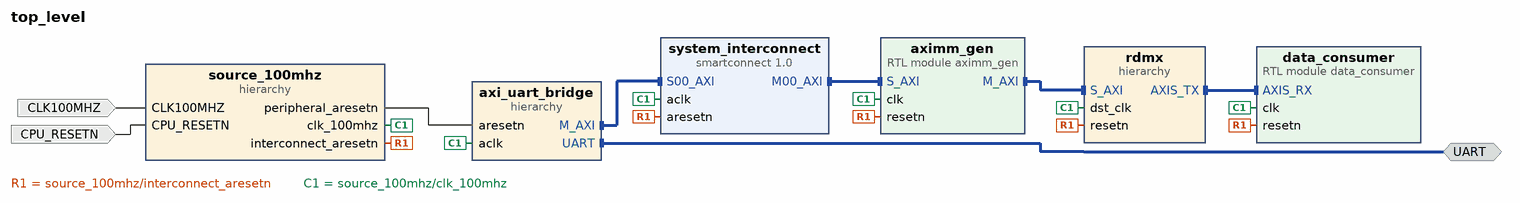
[diagram p0: block diagram of the top level]
# Vivado block design top_level, xc7a100tcsg324-1, Vivado 2021.1
create_bd_design top_level

create_bd_intf_port -mode Master -vlnv xilinx.com:interface:uart_rtl:1.0 UART
create_bd_port -dir I -type clk CLK100MHZ
set_property -dict {CONFIG.ASSOCIATED_RESET CPU_RESETN} [get_bd_ports CLK100MHZ]
create_bd_port -dir I -type rst CPU_RESETN

create_bd_cell -type ip -vlnv xilinx.com:ip:smartconnect:1.0 system_interconnect
set_property -dict {CONFIG.NUM_SI 2} [get_bd_cells system_interconnect]
create_bd_cell -type hier source_100mhz
create_bd_cell -type hier axi_uart_bridge
create_bd_cell -type module -reference data_consumer data_consumer
create_bd_cell -type hier rdmx
create_bd_cell -type module -reference aximm_gen aximm_gen

# ---- hierarchy /source_100mhz ----
current_bd_instance /source_100mhz
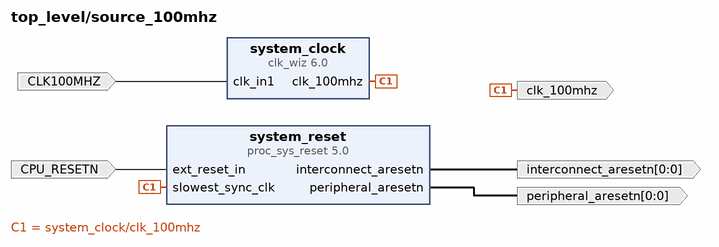
[diagram p1: block diagram inside /source_100mhz]
create_bd_pin -dir I -type clk CLK100MHZ
create_bd_pin -dir O -type clk clk_100mhz
create_bd_pin -dir I -type rst CPU_RESETN
create_bd_pin -dir O -from 0 -to 0 -type rst interconnect_aresetn
create_bd_pin -dir O -from 0 -to 0 -type rst peripheral_aresetn

create_bd_cell -type ip -vlnv xilinx.com:ip:clk_wiz:6.0 system_clock
set_property -dict [list \
  CONFIG.CLKOUT1_DRIVES BUFGCE \
  CONFIG.CLKOUT1_JITTER 151.636 \
  CONFIG.CLKOUT1_REQUESTED_OUT_FREQ 50 \
  CONFIG.CLKOUT2_DRIVES BUFGCE \
  CONFIG.CLKOUT3_DRIVES BUFGCE \
  CONFIG.CLKOUT4_DRIVES BUFGCE \
  CONFIG.CLKOUT5_DRIVES BUFGCE \
  CONFIG.CLKOUT6_DRIVES BUFGCE \
  CONFIG.CLKOUT7_DRIVES BUFGCE \
  CONFIG.CLK_OUT1_PORT clk_100mhz \
  CONFIG.FEEDBACK_SOURCE FDBK_AUTO \
  CONFIG.MMCM_CLKOUT0_DIVIDE_F 20.000 \
  CONFIG.USE_LOCKED false \
  CONFIG.USE_RESET false \
  CONFIG.USE_SAFE_CLOCK_STARTUP true \
] [get_bd_cells system_clock]
create_bd_cell -type ip -vlnv xilinx.com:ip:proc_sys_reset:5.0 system_reset

# ---- hierarchy /axi_uart_bridge ----
current_bd_instance /axi_uart_bridge
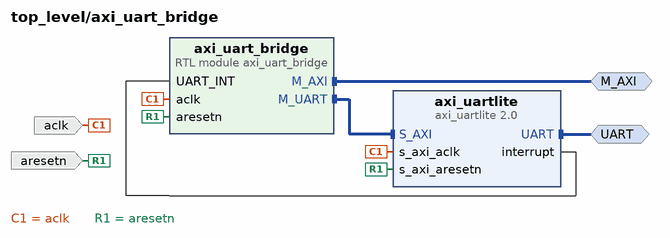
[diagram p2: block diagram inside /axi_uart_bridge]
create_bd_intf_pin -mode Master -vlnv xilinx.com:interface:aximm_rtl:1.0 M_AXI
create_bd_intf_pin -mode Master -vlnv xilinx.com:interface:uart_rtl:1.0 UART
create_bd_pin -dir I -type rst aresetn
create_bd_pin -dir I -type clk aclk

create_bd_cell -type ip -vlnv xilinx.com:ip:axi_uartlite:2.0 axi_uartlite
set_property -dict {CONFIG.C_BAUDRATE 115200} [get_bd_cells axi_uartlite]
create_bd_cell -type module -reference axi_uart_bridge axi_uart_bridge

# ---- hierarchy /rdmx ----
current_bd_instance /rdmx
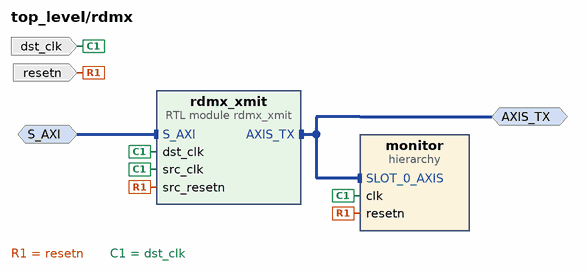
[diagram p3: block diagram inside /rdmx]
create_bd_intf_pin -mode Master -vlnv xilinx.com:interface:axis_rtl:1.0 AXIS_TX
create_bd_intf_pin -mode Slave -vlnv xilinx.com:interface:aximm_rtl:1.0 S_AXI
create_bd_pin -dir I -type clk dst_clk
create_bd_pin -dir I -type rst resetn

create_bd_cell -type hier monitor
create_bd_cell -type module -reference rdmx_xmit rdmx_xmit

# ---- hierarchy /rdmx/monitor ----
current_bd_instance /rdmx/monitor
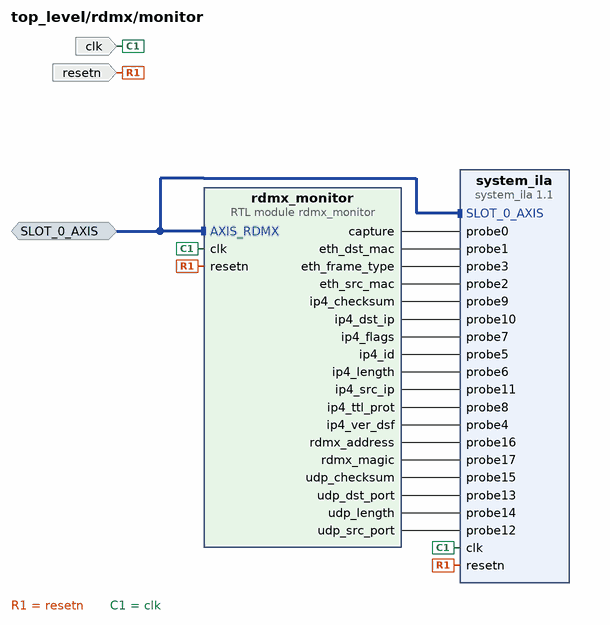
[diagram p4: block diagram inside /rdmx/monitor]
create_bd_intf_pin -mode Monitor -vlnv xilinx.com:interface:axis_rtl:1.0 SLOT_0_AXIS
create_bd_pin -dir I -type clk clk
create_bd_pin -dir I -type rst resetn

create_bd_cell -type ip -vlnv xilinx.com:ip:system_ila:1.1 system_ila
set_property -dict [list \
  CONFIG.ALL_PROBE_SAME_MU_CNT 2 \
  CONFIG.C_EN_STRG_QUAL 1 \
  CONFIG.C_MON_TYPE MIX \
  CONFIG.C_NUM_MONITOR_SLOTS 1 \
  CONFIG.C_NUM_OF_PROBES 18 \
  CONFIG.C_PROBE0_MU_CNT 2 \
  CONFIG.C_PROBE10_MU_CNT 2 \
  CONFIG.C_PROBE11_MU_CNT 2 \
  CONFIG.C_PROBE12_MU_CNT 2 \
  CONFIG.C_PROBE13_MU_CNT 2 \
  CONFIG.C_PROBE14_MU_CNT 2 \
  CONFIG.C_PROBE15_MU_CNT 2 \
  CONFIG.C_PROBE16_MU_CNT 2 \
  CONFIG.C_PROBE17_MU_CNT 2 \
  CONFIG.C_PROBE1_MU_CNT 2 \
  CONFIG.C_PROBE2_MU_CNT 2 \
  CONFIG.C_PROBE3_MU_CNT 2 \
  CONFIG.C_PROBE4_MU_CNT 2 \
  CONFIG.C_PROBE5_MU_CNT 2 \
  CONFIG.C_PROBE6_MU_CNT 2 \
  CONFIG.C_PROBE7_MU_CNT 2 \
  CONFIG.C_PROBE8_MU_CNT 2 \
  CONFIG.C_PROBE9_MU_CNT 2 \
  CONFIG.C_SLOT_0_INTF_TYPE xilinx.com:interface:axis_rtl:1.0 \
] [get_bd_cells system_ila]
create_bd_cell -type module -reference rdmx_monitor rdmx_monitor

# ---- connections ----

current_bd_instance /source_100mhz
connect_bd_net [get_bd_pins CLK100MHZ] [get_bd_pins system_clock/clk_in1]
connect_bd_net [get_bd_pins CPU_RESETN] [get_bd_pins system_reset/ext_reset_in]
connect_bd_net [get_bd_pins system_clock/clk_100mhz] [get_bd_pins clk_100mhz] [get_bd_pins system_reset/slowest_sync_clk]
connect_bd_net [get_bd_pins system_reset/interconnect_aresetn] [get_bd_pins interconnect_aresetn]
connect_bd_net [get_bd_pins system_reset/peripheral_aresetn] [get_bd_pins peripheral_aresetn]

current_bd_instance /axi_uart_bridge
connect_bd_intf_net [get_bd_intf_pins M_AXI] [get_bd_intf_pins axi_uart_bridge/M_AXI]
connect_bd_intf_net [get_bd_intf_pins UART] [get_bd_intf_pins axi_uartlite/UART]
connect_bd_intf_net [get_bd_intf_pins axi_uart_bridge/M_UART] [get_bd_intf_pins axi_uartlite/S_AXI]
connect_bd_net [get_bd_pins aclk] [get_bd_pins axi_uartlite/s_axi_aclk] [get_bd_pins axi_uart_bridge/aclk]
connect_bd_net [get_bd_pins aresetn] [get_bd_pins axi_uartlite/s_axi_aresetn] [get_bd_pins axi_uart_bridge/aresetn]
connect_bd_net [get_bd_pins axi_uartlite/interrupt] [get_bd_pins axi_uart_bridge/UART_INT]

current_bd_instance /rdmx
connect_bd_intf_net [get_bd_intf_pins S_AXI] [get_bd_intf_pins rdmx_xmit/S_AXI]
connect_bd_intf_net [get_bd_intf_pins AXIS_TX] [get_bd_intf_pins rdmx_xmit/AXIS_TX]
connect_bd_intf_net [get_bd_intf_pins AXIS_TX] [get_bd_intf_pins monitor/SLOT_0_AXIS]
connect_bd_net -net source_100mhz_interconnect_aresetn [get_bd_pins resetn] [get_bd_pins monitor/resetn] [get_bd_pins rdmx_xmit/src_resetn]
connect_bd_net -net system_clock_clk_100mhz [get_bd_pins dst_clk] \
  [get_bd_pins monitor/clk] [get_bd_pins rdmx_xmit/src_clk] [get_bd_pins rdmx_xmit/dst_clk]

current_bd_instance /rdmx/monitor
connect_bd_intf_net -intf_net AXIS_ADDR [get_bd_intf_pins SLOT_0_AXIS] [get_bd_intf_pins system_ila/SLOT_0_AXIS]
connect_bd_intf_net [get_bd_intf_pins SLOT_0_AXIS] [get_bd_intf_pins rdmx_monitor/AXIS_RDMX]
connect_bd_net -net capture [get_bd_pins rdmx_monitor/capture] [get_bd_pins system_ila/probe0]
connect_bd_net [get_bd_pins rdmx_monitor/eth_dst_mac] [get_bd_pins system_ila/probe1]
connect_bd_net [get_bd_pins rdmx_monitor/eth_frame_type] [get_bd_pins system_ila/probe3]
connect_bd_net [get_bd_pins rdmx_monitor/eth_src_mac] [get_bd_pins system_ila/probe2]
connect_bd_net [get_bd_pins rdmx_monitor/ip4_checksum] [get_bd_pins system_ila/probe9]
connect_bd_net [get_bd_pins rdmx_monitor/ip4_dst_ip] [get_bd_pins system_ila/probe10]
connect_bd_net [get_bd_pins rdmx_monitor/ip4_flags] [get_bd_pins system_ila/probe7]
connect_bd_net [get_bd_pins rdmx_monitor/ip4_id] [get_bd_pins system_ila/probe5]
connect_bd_net [get_bd_pins rdmx_monitor/ip4_length] [get_bd_pins system_ila/probe6]
connect_bd_net [get_bd_pins rdmx_monitor/ip4_src_ip] [get_bd_pins system_ila/probe11]
connect_bd_net [get_bd_pins rdmx_monitor/ip4_ttl_prot] [get_bd_pins system_ila/probe8]
connect_bd_net [get_bd_pins rdmx_monitor/ip4_ver_dsf] [get_bd_pins system_ila/probe4]
connect_bd_net [get_bd_pins rdmx_monitor/rdmx_address] [get_bd_pins system_ila/probe16]
connect_bd_net [get_bd_pins rdmx_monitor/rdmx_magic] [get_bd_pins system_ila/probe17]
connect_bd_net [get_bd_pins rdmx_monitor/udp_checksum] [get_bd_pins system_ila/probe15]
connect_bd_net [get_bd_pins rdmx_monitor/udp_dst_port] [get_bd_pins system_ila/probe13]
connect_bd_net [get_bd_pins rdmx_monitor/udp_length] [get_bd_pins system_ila/probe14]
connect_bd_net [get_bd_pins rdmx_monitor/udp_src_port] [get_bd_pins system_ila/probe12]
connect_bd_net -net source_100mhz_interconnect_aresetn [get_bd_pins resetn] [get_bd_pins system_ila/resetn] [get_bd_pins rdmx_monitor/resetn]
connect_bd_net -net system_clock_clk_100mhz [get_bd_pins clk] [get_bd_pins system_ila/clk] [get_bd_pins rdmx_monitor/clk]

current_bd_instance /
connect_bd_intf_net [get_bd_intf_pins rdmx/S_AXI] [get_bd_intf_pins aximm_gen/M_AXI]
connect_bd_intf_net -intf_net hier_0_M_AXI [get_bd_intf_pins system_interconnect/S00_AXI] [get_bd_intf_pins axi_uart_bridge/M_AXI]
connect_bd_intf_net -intf_net hier_0_UART [get_bd_intf_ports UART] [get_bd_intf_pins axi_uart_bridge/UART]
connect_bd_intf_net -intf_net rdmx_xmit_AXIS_TX [get_bd_intf_pins data_consumer/AXIS_RX] [get_bd_intf_pins rdmx/AXIS_TX]
connect_bd_intf_net [get_bd_intf_pins aximm_gen/S_AXI] [get_bd_intf_pins system_interconnect/M00_AXI]
connect_bd_net [get_bd_ports CLK100MHZ] [get_bd_pins source_100mhz/CLK100MHZ]
connect_bd_net [get_bd_ports CPU_RESETN] [get_bd_pins source_100mhz/CPU_RESETN]
connect_bd_net [get_bd_pins source_100mhz/interconnect_aresetn] \
  [get_bd_pins system_interconnect/aresetn] [get_bd_pins data_consumer/resetn] [get_bd_pins rdmx/resetn] \
  [get_bd_pins aximm_gen/resetn]
connect_bd_net [get_bd_pins source_100mhz/peripheral_aresetn] [get_bd_pins axi_uart_bridge/aresetn]
connect_bd_net -net system_clock_clk_100mhz [get_bd_pins source_100mhz/clk_100mhz] \
  [get_bd_pins system_interconnect/aclk] [get_bd_pins axi_uart_bridge/aclk] [get_bd_pins data_consumer/clk] \
  [get_bd_pins rdmx/dst_clk] [get_bd_pins aximm_gen/clk]

# ---- address map ----
assign_bd_address -offset 0x0000000000000000 -range 4G -target_address_space [get_bd_addr_spaces axi_uart_bridge/axi_uart_bridge/M_AXI] [get_bd_addr_segs aximm_gen/S_AXI/reg0]
assign_bd_address -offset 0x40600000 -range 64K -target_address_space [get_bd_addr_spaces axi_uart_bridge/axi_uart_bridge/M_UART] [get_bd_addr_segs axi_uart_bridge/axi_uartlite/S_AXI/Reg]
assign_bd_address -offset 0x0000000000000000 -range 16E -target_address_space [get_bd_addr_spaces aximm_gen/M_AXI] [get_bd_addr_segs rdmx/rdmx_xmit/S_AXI/reg0]

validate_bd_design
save_bd_design
